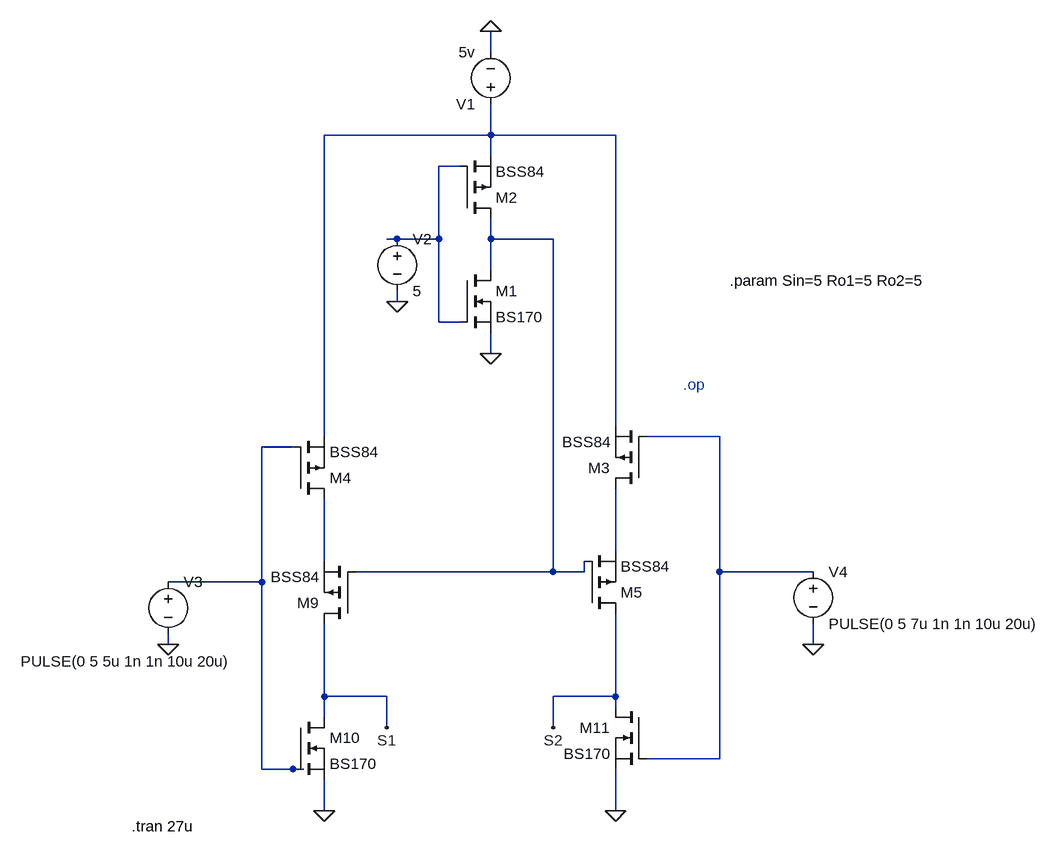
[diagram p0: schematic steering_circuit.asc]
steering_circuit.asc, the LTspice schematic file:
Version 4.1
SHEET 1 1140 1000
WIRE 240 -240 240 -272
WIRE 240 -112 240 -160
WIRE 240 -112 -16 -112
WIRE 432 -112 240 -112
WIRE 240 -80 240 -112
WIRE 192 -64 160 -64
WIRE 96 48 80 48
WIRE 160 48 160 -64
WIRE 160 48 96 48
WIRE 240 48 240 16
WIRE 336 48 240 48
WIRE 240 96 240 48
WIRE 96 144 96 128
WIRE 160 176 160 48
WIRE 192 176 160 176
WIRE 240 224 240 192
WIRE 432 336 432 -112
WIRE -16 352 -16 -112
WIRE 592 352 480 352
WIRE -64 368 -112 368
WIRE 432 528 432 432
WIRE -16 544 -16 448
WIRE 336 560 336 48
WIRE 336 560 32 560
WIRE 384 560 384 544
WIRE 384 560 336 560
WIRE 592 560 592 352
WIRE 736 560 592 560
WIRE -112 576 -112 368
WIRE -112 576 -256 576
WIRE -256 672 -256 656
WIRE 736 672 736 640
WIRE -16 752 -16 640
WIRE 80 752 -16 752
WIRE 432 752 432 624
WIRE 432 752 336 752
WIRE 432 768 432 752
WIRE -16 784 -16 752
WIRE 80 800 80 752
WIRE 336 800 336 752
WIRE 592 848 592 560
WIRE 592 848 480 848
WIRE -112 864 -112 576
WIRE -64 864 -112 864
WIRE -48 864 -64 864
WIRE -16 928 -16 880
WIRE 432 928 432 864
FLAG 240 -272 0
FLAG 240 224 0
FLAG -16 928 0
FLAG 432 928 0
FLAG 80 800 S1
FLAG 336 800 S2
FLAG 96 144 0
FLAG -256 672 0
FLAG 736 672 0
SYMBOL voltage 240 -144 R180
WINDOW 123 0 0 Left 0
WINDOW 39 0 0 Left 0
SYMATTR InstName V1
SYMATTR Value 5v
SYMBOL voltage 96 32 R0
WINDOW 123 0 0 Left 0
WINDOW 39 0 0 Left 0
SYMATTR InstName V2
SYMATTR Value 5
SYMBOL voltage -256 560 R0
WINDOW 123 0 0 Left 0
WINDOW 39 0 0 Left 0
WINDOW 3 -227 138 Left 2
SYMATTR InstName V3
SYMATTR Value PULSE(0 5 5u 1n 1n 10u 20u)
SYMBOL voltage 736 544 R0
WINDOW 123 0 0 Left 0
WINDOW 39 0 0 Left 0
SYMATTR InstName V4
SYMATTR Value PULSE(0 5 7u 1n 1n 10u 20u)
SYMBOL pmos 32 640 R180
SYMATTR InstName M9
SYMATTR Value BSS84
SYMBOL pmos 192 16 M180
SYMATTR InstName M2
SYMATTR Value BSS84
SYMBOL pmos 480 432 R180
SYMATTR InstName M3
SYMATTR Value BSS84
SYMBOL pmos -64 448 M180
SYMATTR InstName M4
SYMATTR Value BSS84
SYMBOL pmos 384 624 M180
SYMATTR InstName M5
SYMATTR Value BSS84
SYMBOL nmos -64 784 R0
SYMATTR InstName M10
SYMATTR Value BS170
SYMBOL nmos 480 768 M0
SYMATTR InstName M11
SYMATTR Value BS170
SYMBOL nmos 192 96 R0
SYMATTR InstName M1
SYMATTR Value BS170
TEXT 608 112 Left 2 !.param Sin=5 Ro1=5 Ro2=5
TEXT -312 952 Left 2 !.tran 27u
TEXT 536 272 Left 2 ;.op

The netlist it stands for:
* steering_circuit.asc
V1 N001 0 5v
V2 N002 0 5
V3 N005 0 PULSE(0 5 5u 1n 1n 10u 20u)
V4 N004 0 PULSE(0 5 7u 1n 1n 10u 20u)
M9 S1 N003 N007 N007 BSS84
M2 N003 N002 N001 N001 BSS84
M3 N006 N004 N001 N001 BSS84
M4 N007 N005 N001 N001 BSS84
M5 S2 N003 N006 N006 BSS84
M10 S1 N005 0 0 BS170
M11 S2 N004 0 0 BS170
M1 N003 N002 0 0 BS170
.model NMOS NMOS
.model PMOS PMOS
.lib standard.mos
.param Sin=5 Ro1=5 Ro2=5
.tran 27u
* .op
.backanno
.end